# EAGLE schematic axiom_beta_power_adapter_v0.1.63a69e4d (EAGLE 7.7.0)
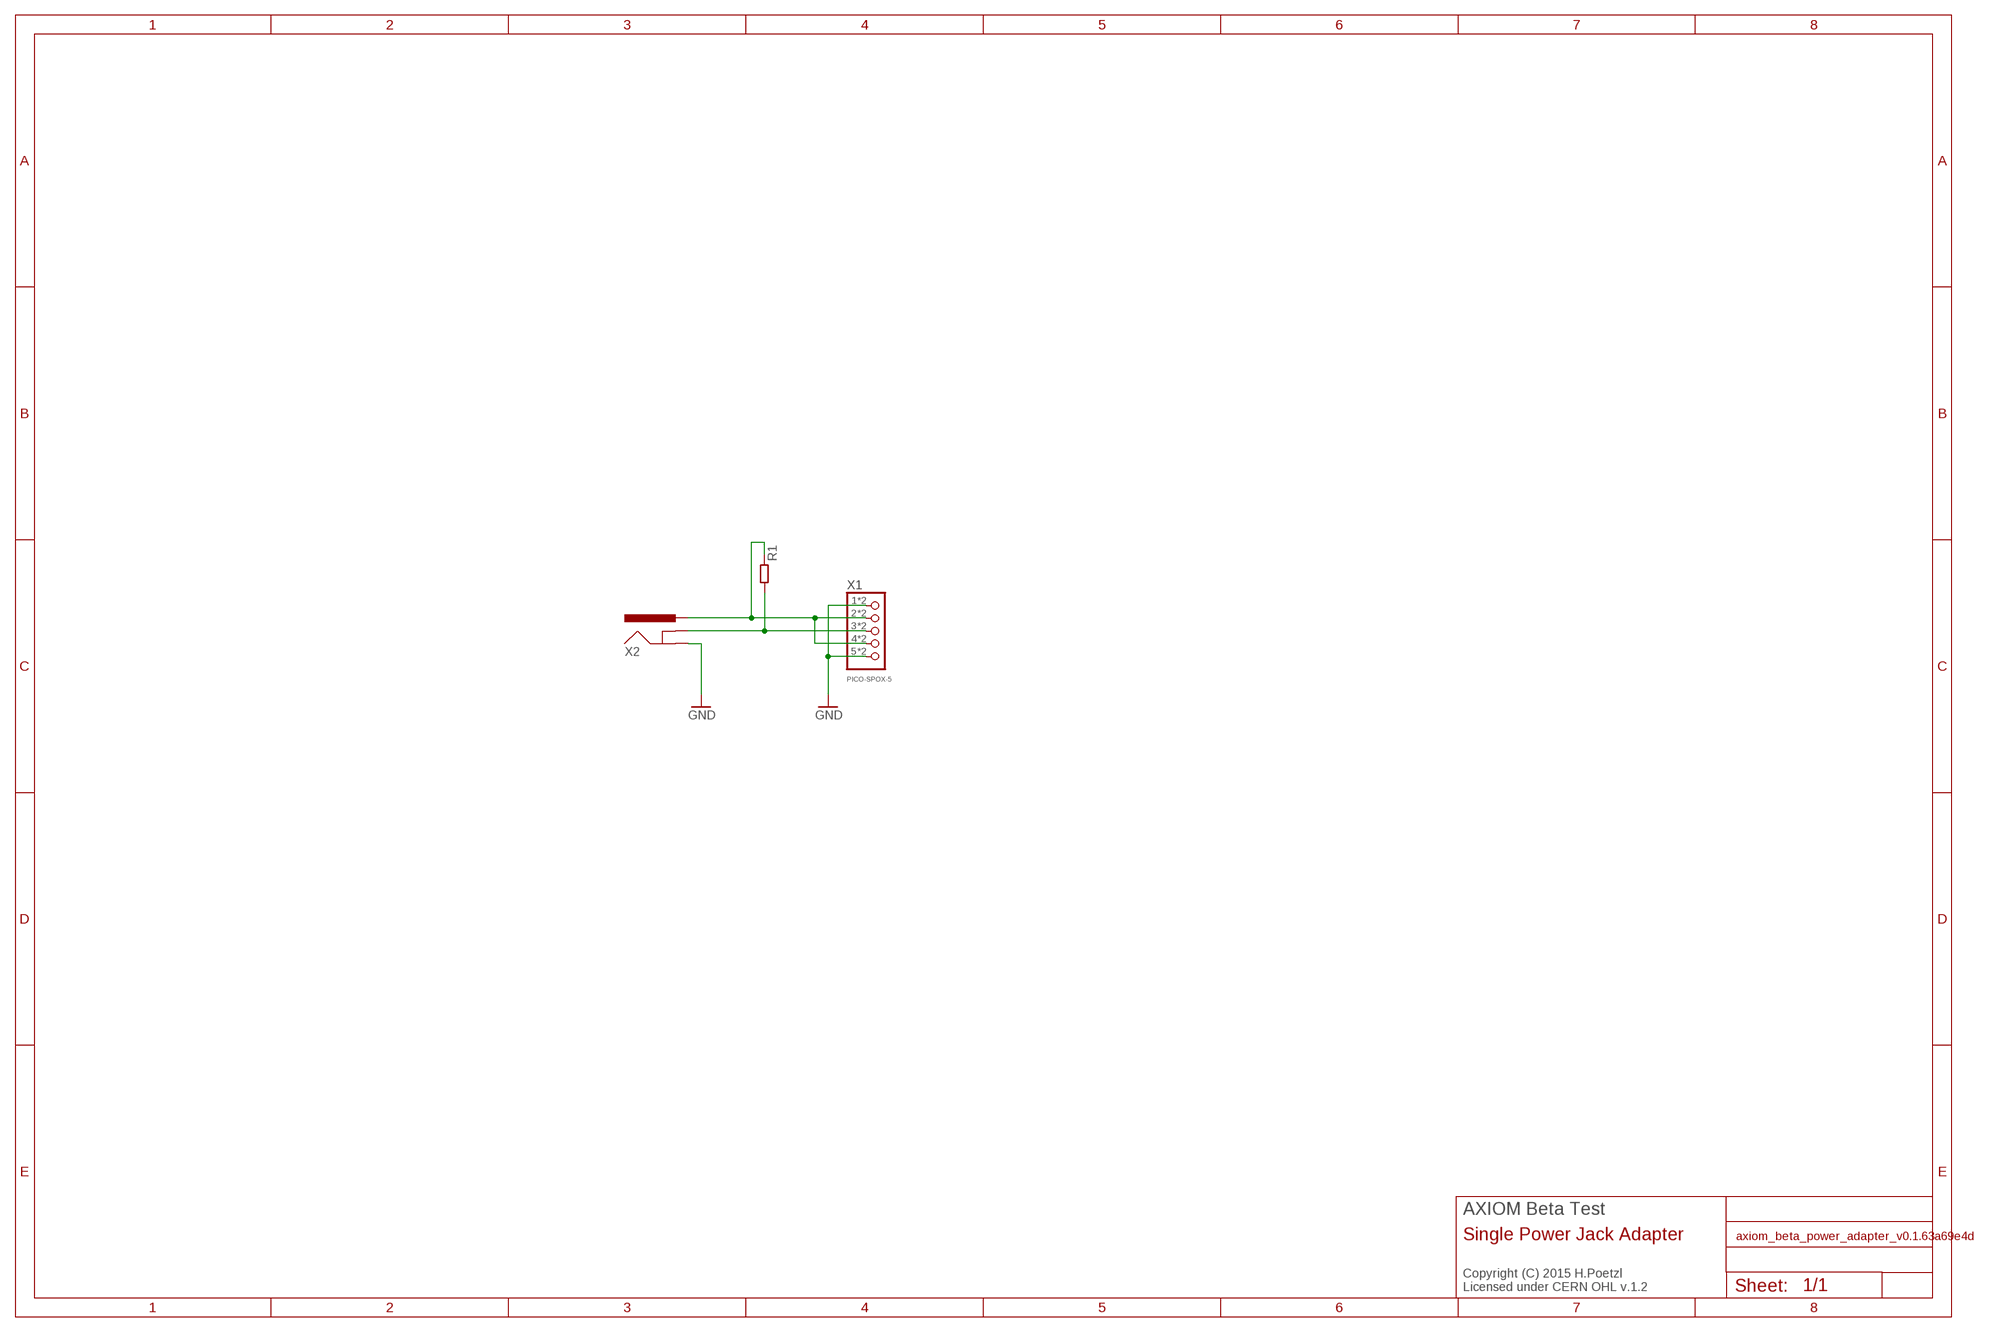
[diagram p0: schematic, sheet 1]

## Parts
R1  R0402-B  [0402-B]
X1  PICO-SPOX-5  [PICO-SPOX-5]
X2  POWER_JACKPTH  [POWER_JACK_PTH]

## Nets
BETA_5V: R1.1 X1.2 X1.2A X1.4 X1.4A X2.PWR
GND: X1.1 X1.1A X1.5 X1.5A X2.GND
VIN: R1.2 X1.3 X1.3A X2.SHUNT(GNDBREAK)

## Notes on the sheet
- AXIOM Beta Test
- Single Power Jack Adapter
- Copyright (C) 2015 H.Poetzl
  Licensed under CERN OHL v.1.2

## Library data of the parts
R1 = generic-rcl:R
X1 = pico-spox:PICO-SPOX-5
X2 = power_jack:POWER_JACK: RASM712PX Right Angle SMT Mount DC Power Jack, pin size 0.100"(2.5mm), with locating post Switchcraft.com

## Net classes
1 LVDS: width 0.152 mm, drill 0.254 mm, clearance 0.152 mm